# EAGLE design HueDot9-RevA (EAGLE 6.5.0)
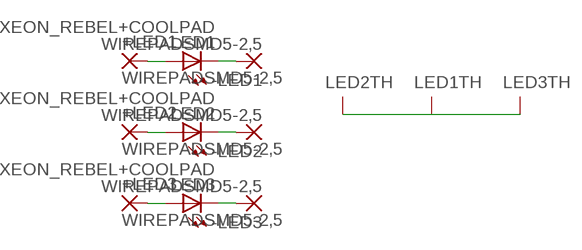
[diagram p0: schematic, sheet 1]

## Parts
+LED1  WIREPADSMD5-2,5  [5-2,5]
+LED2  WIREPADSMD5-2,5  [5-2,5]
+LED3  WIREPADSMD5-2,5  [5-2,5]
-LED1  WIREPADSMD5-2,5  [5-2,5]
-LED2  WIREPADSMD5-2,5  [5-2,5]
-LED3  WIREPADSMD5-2,5  [5-2,5]
LED1  LUXEON_REBEL+COOLPAD  [LUXEON_REBEL+COOLPAD]
LED2  LUXEON_REBEL+COOLPAD  [LUXEON_REBEL+COOLPAD]
LED3  LUXEON_REBEL+COOLPAD  [LUXEON_REBEL+COOLPAD]

## Nets
AN1: +LED1.1(P) LED1.A LED1.A@1(A)
AN2: +LED2.1(P) LED2.A LED2.A@1(A)
AN3: +LED3.1(P) LED3.A LED3.A@1(A)
CA1: -LED1.1(P) LED1.C LED1.C@1(C)
CA2: -LED2.1(P) LED2.C LED2.C@1(C)
CN3: -LED3.1(P) LED3.C LED3.C@1(C)
TH: LED1.TH LED1.TH@1(TH) LED1.TH@2(TH) LED1.TH@3(TH) LED1.TH@4(TH) LED1.TH@5(TH) LED1.TH@6(TH) LED1.TH@7(TH) LED1.TH@8(TH) LED1.TH@9(TH) LED1.TH@10(TH) LED1.TH@11(TH) LED1.TH@12(TH) LED1.TH@13(TH) LED1.TH@14(TH) LED1.TH@15(TH) LED1.TH@16(TH) LED1.TH@17(TH) LED1.TH@18(TH) LED1.TH@19(TH) LED1.TH@20(TH) LED1.TH@21(TH) LED1.TH@22(TH) LED1.TH@23(TH) LED1.TH@24(TH) LED1.TH@25(TH) LED1.TH@26(TH) LED1.TH@27(TH) LED1.TH@28(TH) LED1.TH@29(TH) LED1.TH@30(TH) LED1.TH@31(TH) LED1.TH@32(TH) LED1.TH@33(TH) LED1.TH@34(TH) LED1.TH@35(TH) LED2.TH LED2.TH@1(TH) LED2.TH@2(TH) LED2.TH@3(TH) LED2.TH@4(TH) LED2.TH@5(TH) LED2.TH@6(TH) LED2.TH@7(TH) LED2.TH@8(TH) LED2.TH@9(TH) LED2.TH@10(TH) LED2.TH@11(TH) LED2.TH@12(TH) LED2.TH@13(TH) LED2.TH@14(TH) LED2.TH@15(TH) LED2.TH@16(TH) LED2.TH@17(TH) LED2.TH@18(TH) LED2.TH@19(TH) LED2.TH@20(TH) LED2.TH@21(TH) LED2.TH@22(TH) LED2.TH@23(TH) LED2.TH@24(TH) LED2.TH@25(TH) LED2.TH@26(TH) LED2.TH@27(TH) LED2.TH@28(TH) LED2.TH@29(TH) LED2.TH@30(TH) LED2.TH@31(TH) LED2.TH@32(TH) LED2.TH@33(TH) LED2.TH@34(TH) LED2.TH@35(TH) LED3.TH LED3.TH@1(TH) LED3.TH@2(TH) LED3.TH@3(TH) LED3.TH@4(TH) LED3.TH@5(TH) LED3.TH@6(TH) LED3.TH@7(TH) LED3.TH@8(TH) LED3.TH@9(TH) LED3.TH@10(TH) LED3.TH@11(TH) LED3.TH@12(TH) LED3.TH@13(TH) LED3.TH@14(TH) LED3.TH@15(TH) LED3.TH@16(TH) LED3.TH@17(TH) LED3.TH@18(TH) LED3.TH@19(TH) LED3.TH@20(TH) LED3.TH@21(TH) LED3.TH@22(TH) LED3.TH@23(TH) LED3.TH@24(TH) LED3.TH@25(TH) LED3.TH@26(TH) LED3.TH@27(TH) LED3.TH@28(TH) LED3.TH@29(TH) LED3.TH@30(TH) LED3.TH@31(TH) LED3.TH@32(TH) LED3.TH@33(TH) LED3.TH@34(TH) LED3.TH@35(TH)

## Library data of the parts
+LED1-+LED3 -LED1--LED3 = wirepad:WIREPAD: Wire PAD connect wire on PCB
LED1-LED3 = led-lumiled:LUXEON_REBEL+COOLPAD: LUXEON REBEL LED with cooling pads Display Layer Refence in Board for more information Stop and Cream Mask defined by Luxeon Rebel Footprint _customer.dxf; OC_FARNELL: unknown; OC_NEWARK: unknown

## Board
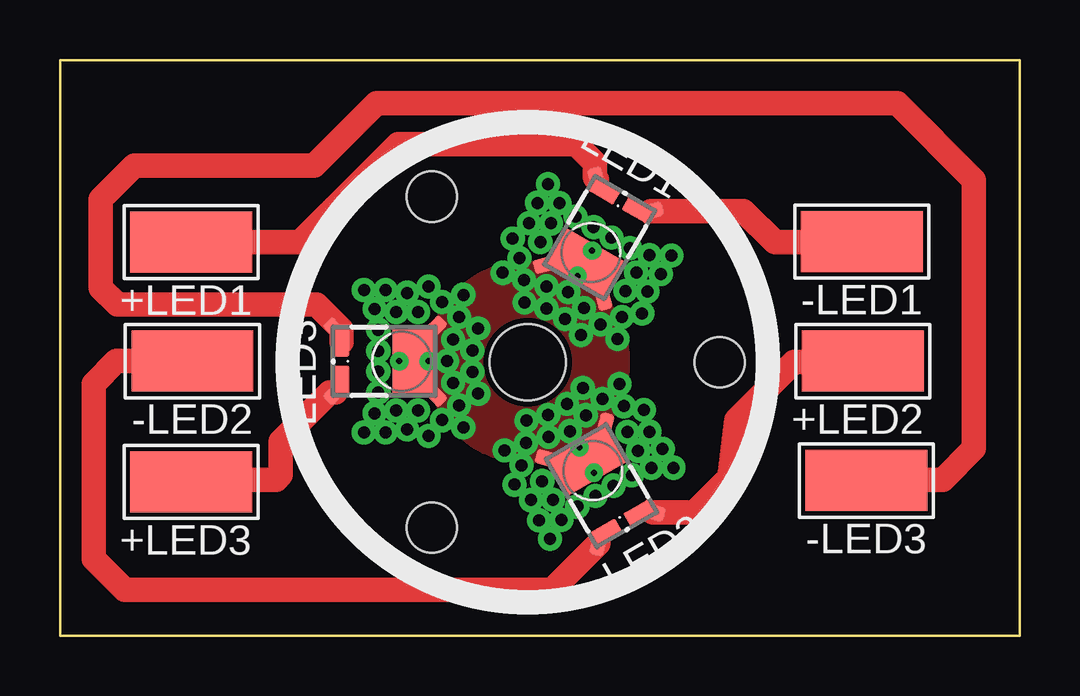
[diagram p1: board, top side]
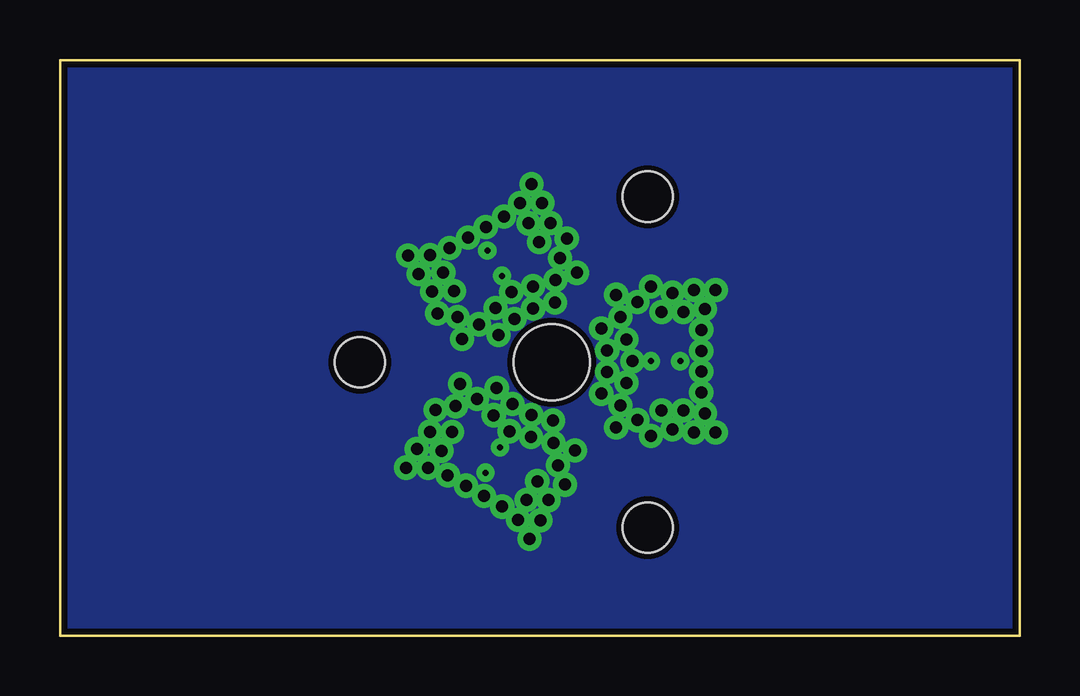
[diagram p2: board, bottom side, seen from below]

Size 40 x 24 mm. Coordinates in mm from the lower left corner, seen from the top.
Outline: 0,24 40,24 40,0 0,0 0,24
Copper layers (1*16): Top 0.035mm / dielectric 1.5mm / Bottom 0.035mm
Design rules "default *": minimum track width 10mil, minimum drill 24mil, track to track 8mil, track to pad 8mil, pad to pad 8mil, via to via 8mil, smd to smd 8mil, copper to edge 10mil, drill to drill 5mil, minimum pad ring 10mil, minimum via ring 8mil, stop-mask expansion 4mil, vias tented up to drill 0mil, thermal gap 10mil
Holes 3.17 mm at 19.5,11.4
Holes 2.1 mm at 27.5,11.4 15.5,18.3 15.5,4.5

### Footprints (pad centres in the part's own frame; a part is rotated, then mirrored left to right if it is on the bottom)
5-2,5 = smd 2.54 x 5.08: 1 0,0
LUXEON_REBEL+COOLPAD = smd 1.2 x 0.67: A 0.8,-2.51; C -0.8,-2.51 | smd 1 x 0.6 rotated 315: A@1 1.31,-2.75 | smd 1 x 0.6 rotated 225: C@1 -1.31,-2.75 | smd 2.8 x 1.77: TH 0,0.51 | smd 1 x 0.6 rotated 135: TH@1 -1.39,1.39 | smd 1 x 0.6 rotated 45: TH@2 1.39,1.39 | drill 0.5 pad 0.6: TH@3 2.971,-1.57; TH@4 2.971,-0.67; TH@5 2.85,0.23; TH@6 2.05,0.68; TH@7 2.05,-0.22; TH@8 2.171,-1.12; TH@9 2.764,2.575; TH@10 3.116,1.13; TH@11 2.461,1.687; TH@12 1.844,2.394; TH@13 0.9,2.15; TH@14 0,1.9; TH@15 0.45,2.95; TH@16 1.356,3.196; TH@17 1.31,-0.97; TH@18 0.43,-0.97; TH@21 -2.971,-1.57; TH@22 -2.971,-0.67; TH@23 -2.85,0.23; TH@24 -2.05,0.68; TH@25 -2.05,-0.22; TH@26 -2.171,-1.12; TH@27 -2.764,2.575; TH@28 -3.116,1.13; TH@29 -2.461,1.687; TH@30 -1.844,2.394; TH@31 -0.9,2.15; TH@32 -0.45,2.95; TH@33 -1.356,3.196; TH@34 -1.31,-0.97; TH@35 -0.43,-0.97 | drill 0.25 pad 0.4: TH@19 0,-0.095; TH@20 0,1.125

### Placement (x,y rotation side)
+LED1  5.47,16.4 90 top
+LED2  33.47,11.44 90 top
+LED3  5.47,6.4 90 top
-LED1  33.42,16.42 90 top
-LED2  5.52,11.44 90 top
-LED3  33.62,6.46 90 top
LED1  22.14,15.97 150 top
LED2  22.22,6.87 30 top
LED3  14.24,11.44 270 top

### Tracks (layer width: path | path; a pad name or v marks a point on that pad's centre or on a via)
AN1
  Top 1.016: +LED1.1 10,16.4 14.1,20.5 21.5,20.5 22.3,19.7 22.3,19.09 LED1.A@1
AN2
  Top 1.016: LED2.A@1 26.45,5.15 27.9,6.6 28.2,9 30.6,11.4 33.43,11.4 +LED2.1
AN3
  Top 1.016: LED3.A@1 11.23,10.13 9.2,8.1 9.2,6.7 9,6.5 5.57,6.5 +LED3.1
CA1
  Top 1.016: LED1.C@1 28.5,17.7 29.8,16.4 34,16.4 34.1,16.3 33.54,16.3 -LED1.1
CA2
  Top 1.016: -LED2.1 2.34,11.44 1.4,10.5 1.4,3.2 2.7,1.9 20.52,1.9 LED2.C@1
CN3
  Top 1.016: LED3.C 11.73,12.77 10.7,13.8 2.4,13.8 1.7,14.5 1.7,18.2 3.1,19.6 10.6,19.6 13.2,22.2 34.9,22.2 38.1,19 38.1,7.8 36.8,6.5 33.66,6.5 -LED3.1
TH
  pour Top (no thermals): 15.5,11.4 arc-90 19.5,15.4 arc-90 23.5,11.4 arc-90 19.5,7.4 arc-90
  pour Bottom (no thermals): 0.6,23.4 39.4,23.4 39.4,0.6 0.6,0.6